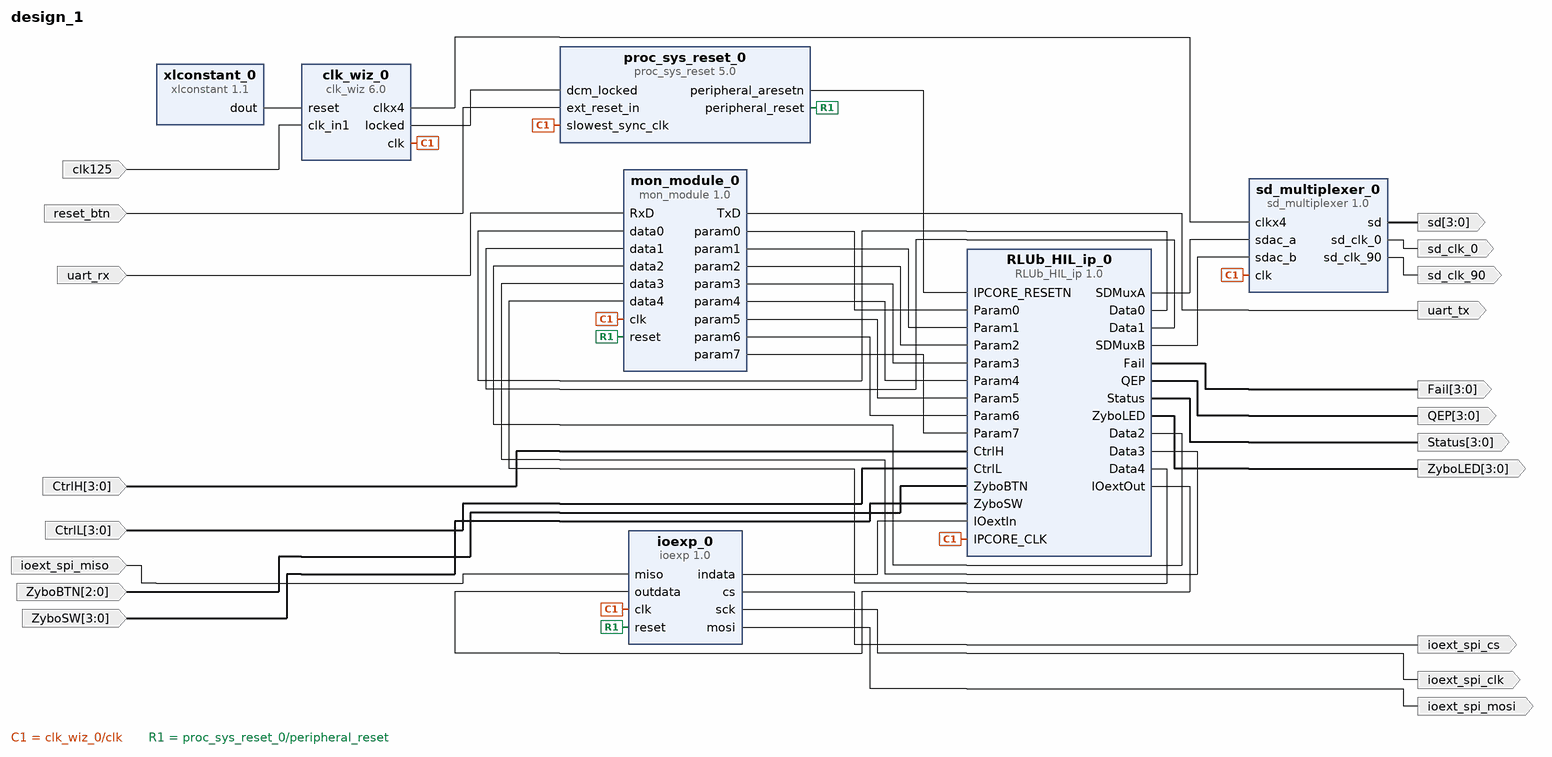
[diagram p0: block diagram of the top level]
# Vivado block design design_1, xc7z010clg400-1, Vivado 2018.2.2
create_bd_design design_1

create_bd_port -dir I -type clk clk125
set_property -dict {CONFIG.FREQ_HZ 125000000} [get_bd_ports clk125]
create_bd_port -dir O ioext_spi_cs
create_bd_port -dir O ioext_spi_mosi
create_bd_port -dir O ioext_spi_clk
create_bd_port -dir I ioext_spi_miso
create_bd_port -dir O uart_tx
create_bd_port -dir I -type rst reset_btn
set_property -dict {CONFIG.POLARITY ACTIVE_HIGH} [get_bd_ports reset_btn]
create_bd_port -dir O -from 3 -to 0 sd
create_bd_port -dir O sd_clk_0
create_bd_port -dir O sd_clk_90
create_bd_port -dir I uart_rx
create_bd_port -dir O -from 3 -to 0 QEP
create_bd_port -dir O -from 3 -to 0 Fail
create_bd_port -dir I -from 3 -to 0 CtrlH
create_bd_port -dir I -from 3 -to 0 CtrlL
create_bd_port -dir O -from 3 -to 0 Status
create_bd_port -dir I -from 2 -to 0 ZyboBTN
create_bd_port -dir I -from 3 -to 0 ZyboSW
create_bd_port -dir O -from 3 -to 0 ZyboLED

create_bd_cell -type ip -vlnv xilinx.com:ip:clk_wiz:6.0 clk_wiz_0
set_property -dict [list \
  CONFIG.CLKIN1_JITTER_PS 80.0 \
  CONFIG.CLKOUT1_USED true \
  CONFIG.CLKOUT2_USED true \
  CONFIG.CLKOUT3_USED false \
  CONFIG.CLKOUT4_USED false \
  CONFIG.CLKOUT5_USED false \
  CONFIG.NUM_OUT_CLKS 2 \
  CONFIG.CLK_OUT1_PORT clkx4 \
  CONFIG.CLK_OUT2_PORT clk \
  CONFIG.CLK_OUT3_PORT clk_out3 \
  CONFIG.CLK_OUT4_PORT clk_out4 \
  CONFIG.CLKOUT1_REQUESTED_OUT_FREQ 80.000 \
  CONFIG.CLKOUT1_REQUESTED_DUTY_CYCLE 65.000 \
  CONFIG.CLKOUT2_REQUESTED_OUT_FREQ 20.000 \
  CONFIG.CLKOUT2_REQUESTED_DUTY_CYCLE 50.000 \
  CONFIG.CLKOUT3_REQUESTED_OUT_FREQ 100.000 \
  CONFIG.CLKOUT4_REQUESTED_OUT_FREQ 100.000 \
  CONFIG.RESET_PORT reset \
  CONFIG.MMCM_DIVCLK_DIVIDE 5 \
  CONFIG.MMCM_CLKFBOUT_MULT_F 32.000 \
  CONFIG.MMCM_CLKIN1_PERIOD 8.000 \
  CONFIG.MMCM_CLKOUT0_DIVIDE_F 10.000 \
  CONFIG.MMCM_CLKOUT0_DUTY_CYCLE 0.650 \
  CONFIG.MMCM_CLKOUT1_DIVIDE 40 \
  CONFIG.MMCM_CLKOUT1_DUTY_CYCLE 0.500 \
  CONFIG.MMCM_CLKOUT2_DIVIDE 1 \
  CONFIG.MMCM_CLKOUT3_DIVIDE 1 \
  CONFIG.MMCM_CLKOUT4_DIVIDE 1 \
  CONFIG.RESET_TYPE ACTIVE_HIGH \
  CONFIG.CLKOUT1_JITTER 277.027 \
  CONFIG.CLKOUT1_PHASE_ERROR 265.359 \
  CONFIG.CLKOUT2_JITTER 369.430 \
  CONFIG.CLKOUT2_PHASE_ERROR 265.359 \
  CONFIG.CLKOUT3_JITTER 265.121 \
  CONFIG.CLKOUT3_PHASE_ERROR 265.359 \
  CONFIG.CLKOUT4_JITTER 265.121 \
  CONFIG.CLKOUT4_PHASE_ERROR 265.359 \
  CONFIG.CLKOUT5_JITTER 265.121 \
  CONFIG.CLKOUT5_PHASE_ERROR 265.359 \
] [get_bd_cells clk_wiz_0]
create_bd_cell -type ip -vlnv aut.bme.hu:fiek:ioexp:1.0 ioexp_0
create_bd_cell -type ip -vlnv aut.bme.hu:user:mon_module:1.0 mon_module_0
set_property -dict {CONFIG.baud_rate_step 0x1798} [get_bd_cells mon_module_0]
create_bd_cell -type ip -vlnv xilinx.com:ip:proc_sys_reset:5.0 proc_sys_reset_0
set_property -dict {CONFIG.C_NUM_PERP_ARESETN 1 CONFIG.C_EXT_RST_WIDTH 4} [get_bd_cells proc_sys_reset_0]
create_bd_cell -type ip -vlnv aut.bme.hu:fiek:sd_multiplexer:1.0 sd_multiplexer_0
create_bd_cell -type ip -vlnv xilinx.com:ip:xlconstant:1.1 xlconstant_0
set_property -dict {CONFIG.CONST_VAL 0} [get_bd_cells xlconstant_0]
create_bd_cell -type ip -vlnv xilinx.com:ip:RLUb_HIL_ip:1.0 RLUb_HIL_ip_0

# ---- connections ----

connect_bd_net -net clk125_1 [get_bd_ports clk125] [get_bd_pins clk_wiz_0/clk_in1]
connect_bd_net [get_bd_pins clk_wiz_0/clk] \
  [get_bd_pins ioexp_0/clk] [get_bd_pins mon_module_0/clk] [get_bd_pins proc_sys_reset_0/slowest_sync_clk] \
  [get_bd_pins sd_multiplexer_0/clk] [get_bd_pins RLUb_HIL_ip_0/IPCORE_CLK]
connect_bd_net [get_bd_pins clk_wiz_0/clkx4] [get_bd_pins sd_multiplexer_0/clkx4]
connect_bd_net [get_bd_pins clk_wiz_0/locked] [get_bd_pins proc_sys_reset_0/dcm_locked]
connect_bd_net [get_bd_pins ioexp_0/cs] [get_bd_ports ioext_spi_cs]
connect_bd_net [get_bd_pins ioexp_0/mosi] [get_bd_ports ioext_spi_mosi]
connect_bd_net [get_bd_pins ioexp_0/sck] [get_bd_ports ioext_spi_clk]
connect_bd_net [get_bd_ports ioext_spi_miso] [get_bd_pins ioexp_0/miso]
connect_bd_net [get_bd_pins mon_module_0/TxD] [get_bd_ports uart_tx]
connect_bd_net [get_bd_pins proc_sys_reset_0/peripheral_reset] [get_bd_pins ioexp_0/reset] [get_bd_pins mon_module_0/reset]
connect_bd_net [get_bd_ports reset_btn] [get_bd_pins proc_sys_reset_0/ext_reset_in]
connect_bd_net [get_bd_pins sd_multiplexer_0/sd] [get_bd_ports sd]
connect_bd_net [get_bd_pins sd_multiplexer_0/sd_clk_0] [get_bd_ports sd_clk_0]
connect_bd_net [get_bd_pins sd_multiplexer_0/sd_clk_90] [get_bd_ports sd_clk_90]
connect_bd_net [get_bd_ports uart_rx] [get_bd_pins mon_module_0/RxD]
connect_bd_net [get_bd_pins xlconstant_0/dout] [get_bd_pins clk_wiz_0/reset]
connect_bd_net [get_bd_pins RLUb_HIL_ip_0/IOextOut] [get_bd_pins ioexp_0/outdata]
connect_bd_net [get_bd_pins ioexp_0/indata] [get_bd_pins RLUb_HIL_ip_0/IOextIn]
connect_bd_net [get_bd_pins RLUb_HIL_ip_0/SDMuxA] [get_bd_pins sd_multiplexer_0/sdac_a]
connect_bd_net [get_bd_pins RLUb_HIL_ip_0/SDMuxB] [get_bd_pins sd_multiplexer_0/sdac_b]
connect_bd_net [get_bd_pins RLUb_HIL_ip_0/Data0] [get_bd_pins mon_module_0/data0]
connect_bd_net [get_bd_pins RLUb_HIL_ip_0/Data1] [get_bd_pins mon_module_0/data1]
connect_bd_net [get_bd_pins RLUb_HIL_ip_0/Data2] [get_bd_pins mon_module_0/data2]
connect_bd_net [get_bd_pins RLUb_HIL_ip_0/Data3] [get_bd_pins mon_module_0/data3]
connect_bd_net [get_bd_pins RLUb_HIL_ip_0/Data4] [get_bd_pins mon_module_0/data4]
connect_bd_net [get_bd_pins mon_module_0/param0] [get_bd_pins RLUb_HIL_ip_0/Param0]
connect_bd_net [get_bd_pins mon_module_0/param1] [get_bd_pins RLUb_HIL_ip_0/Param1]
connect_bd_net [get_bd_pins mon_module_0/param2] [get_bd_pins RLUb_HIL_ip_0/Param2]
connect_bd_net [get_bd_pins mon_module_0/param3] [get_bd_pins RLUb_HIL_ip_0/Param3]
connect_bd_net [get_bd_pins mon_module_0/param4] [get_bd_pins RLUb_HIL_ip_0/Param4]
connect_bd_net [get_bd_pins mon_module_0/param5] [get_bd_pins RLUb_HIL_ip_0/Param5]
connect_bd_net [get_bd_pins mon_module_0/param6] [get_bd_pins RLUb_HIL_ip_0/Param6]
connect_bd_net [get_bd_pins mon_module_0/param7] [get_bd_pins RLUb_HIL_ip_0/Param7]
connect_bd_net [get_bd_pins proc_sys_reset_0/peripheral_aresetn] [get_bd_pins RLUb_HIL_ip_0/IPCORE_RESETN]
connect_bd_net [get_bd_pins RLUb_HIL_ip_0/QEP] [get_bd_ports QEP]
connect_bd_net [get_bd_pins RLUb_HIL_ip_0/Fail] [get_bd_ports Fail]
connect_bd_net [get_bd_ports CtrlH] [get_bd_pins RLUb_HIL_ip_0/CtrlH]
connect_bd_net [get_bd_ports CtrlL] [get_bd_pins RLUb_HIL_ip_0/CtrlL]
connect_bd_net [get_bd_pins RLUb_HIL_ip_0/Status] [get_bd_ports Status]
connect_bd_net [get_bd_ports ZyboBTN] [get_bd_pins RLUb_HIL_ip_0/ZyboBTN]
connect_bd_net [get_bd_ports ZyboSW] [get_bd_pins RLUb_HIL_ip_0/ZyboSW]
connect_bd_net [get_bd_pins RLUb_HIL_ip_0/ZyboLED] [get_bd_ports ZyboLED]

validate_bd_design
save_bd_design
